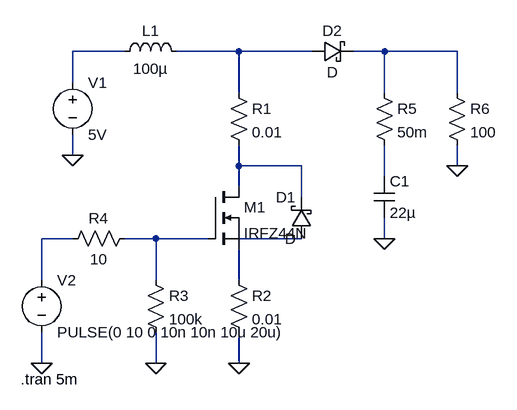
[diagram p0: schematic powerbooster.asc]
powerbooster.asc, the LTspice schematic file:
Version 4.1
SHEET 1 880 680
WIRE -256 -112 -336 -112
WIRE -80 -112 -176 -112
WIRE 32 -112 -80 -112
WIRE 144 -112 96 -112
WIRE 256 -112 144 -112
WIRE -336 -64 -336 -112
WIRE -80 -48 -80 -112
WIRE 144 -48 144 -112
WIRE 256 -48 256 -112
WIRE -336 48 -336 16
WIRE -80 64 -80 32
WIRE 16 64 -80 64
WIRE 256 64 256 32
WIRE 144 80 144 32
WIRE -80 96 -80 64
WIRE 16 112 16 64
WIRE -336 176 -384 176
WIRE -208 176 -256 176
WIRE -128 176 -208 176
WIRE 16 176 -80 176
WIRE 144 176 144 144
WIRE -384 240 -384 176
WIRE -208 240 -208 176
WIRE -80 240 -80 192
WIRE -384 368 -384 320
WIRE -208 368 -208 320
WIRE -80 368 -80 320
FLAG -336 48 0
FLAG 144 176 0
FLAG 256 64 0
FLAG -384 368 0
FLAG -208 368 0
FLAG -80 368 0
SYMBOL ind -272 -96 R270
WINDOW 0 32 56 VTop 2
WINDOW 3 5 56 VBottom 2
SYMATTR InstName L1
SYMATTR Value 100µ
SYMATTR SpiceLine Rser=1m
SYMBOL voltage -336 -80 R0
WINDOW 123 0 0 Left 0
WINDOW 39 0 0 Left 0
SYMATTR InstName V1
SYMATTR Value 5V
SYMBOL res -96 -64 R0
SYMATTR InstName R1
SYMATTR Value 0.01
SYMBOL nmos -128 96 R0
SYMATTR InstName M1
SYMATTR Value IRFZ44N
SYMBOL res -96 224 R0
SYMATTR InstName R2
SYMATTR Value 0.01
SYMBOL res -224 224 R0
SYMATTR InstName R3
SYMATTR Value 100k
SYMBOL res -240 160 R90
WINDOW 0 0 56 VBottom 2
WINDOW 3 32 56 VTop 2
SYMATTR InstName R4
SYMATTR Value 10
SYMBOL voltage -384 224 R0
WINDOW 123 0 0 Left 0
WINDOW 39 0 0 Left 0
SYMATTR InstName V2
SYMATTR Value PULSE(0 10 0 10n 10n 10u 20u)
SYMBOL res 128 -64 R0
SYMATTR InstName R5
SYMATTR Value 50m
SYMBOL cap 128 80 R0
SYMATTR InstName C1
SYMATTR Value 22µ
SYMBOL res 240 -64 R0
SYMATTR InstName R6
SYMATTR Value 100
SYMBOL schottky 32 176 R180
WINDOW 0 24 64 Left 2
WINDOW 3 24 0 Left 2
SYMATTR InstName D1
SYMBOL schottky 32 -96 R270
WINDOW 0 32 32 VTop 2
WINDOW 3 0 32 VBottom 2
SYMATTR InstName D2
TEXT -416 392 Left 2 !.tran 5m

The netlist it stands for:
* powerbooster.asc
L1 N001 N002 100µ Rser=1m
V1 N001 0 5V
R1 N002 N004 0.01
M1 N004 N007 N009 N009 IRFZ44N
R2 N009 0 0.01
R3 N007 0 100k
R4 N007 N006 10
V2 N006 0 PULSE(0 10 0 10n 10n 10u 20u)
R5 N003 N005 50m
C1 N005 0 22µ
R6 N003 0 100
D1 N008 N004 D
D2 N002 N003 D
.model D D
.lib standard.dio
.model NMOS NMOS
.model PMOS PMOS
.lib standard.mos
.tran 5m
.backanno
.end